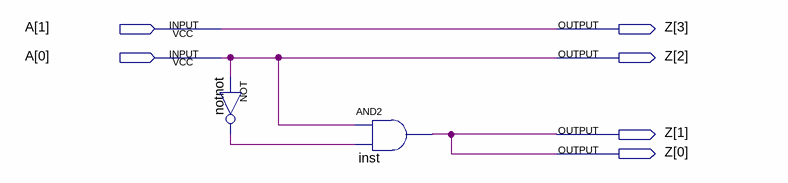
[diagram p0: schematic sheet]
// Quartus schematic Shift.bdf as structural Verilog: 2 symbols, 6 pins
module Shift (
  input  [1:0] A,
  output [3:0] Z
);

  wire notnot_out;

  not notnot (notnot_out, A[0]);
  and inst (Z[1], A[0], notnot_out);

  assign {Z[3:2], Z[0]} = {A, Z[1]};
endmodule
